# Altium project PROC114E3_SCH.PrjPcb (part 22 of 22)
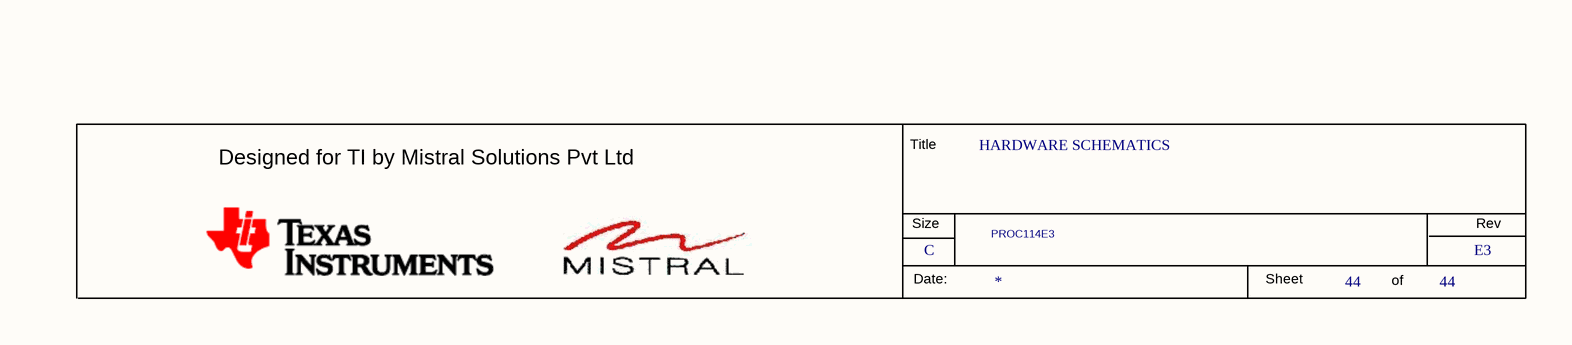
[diagram p82: 44.SchDoc, bottom right]

## Nets that join several sheets
DGND: 09 (47 pins), 10 (17 pins), 11 (31 pins), 12 (30 pins), 13 (22 pins), 14 (41 pins), 15 (120 pins), 16 (44 pins), 17 (94 pins), 18 (23 pins), 19 (16 pins), 20 (11 pins), 21 (13 pins), 22 (47 pins), 23 (47 pins), 24 (12 pins), 25 (18 pins), 26 (36 pins), 27 (49 pins), 28 (16 pins), 29 (31 pins), 30 (11 pins), 31 (70 pins), 32 (9 pins), 33 (22 pins), 34 (19 pins), 35 (17 pins), 36 (14 pins), 37 (27 pins), 38 (13 pins), 39 (12 pins), 40 (15 pins), 41 (43 pins), 42 (9 pins), 43 (14 pins)
SOC_DVDD1V8: 13 (R70.3), 14 (5 pins), 15 (6 pins)
SoC_DVDD3V3: 13 (R48.3), 14 (13 pins), 15 (15 pins)
VBUS_TYPEC2: 09 (10 pins), 35 (8 pins), 36 (R152.2)
VCC1V2_DDR: 12 (5 pins), 13 (C114.2 R134.2)
VCC1V8_CLKBUF: 24 (6 pins), 42 (C334.2 R370.2 U53.4)
VCC3V3_TA: 25 (23 pins), 26 (28 pins), 28 (6 pins)
VCC3V3_XDS: 27 (38 pins), 28 (15 pins), 29 (6 pins)
VCC_0V85: 12 (5 pins), 13 (C106.2 R123.2)
VCC_1V8: 12 (C52.1 L5.2 TP41.1 U14.3), 13 (C53.2 R70.2), 17 (13 pins), 18 (20 pins), 20 (22 pins), 24 (FL22.1), 34 (C321.1 R107.1 U20.1), 37 (5 pins), 39 (C496.2 U60.1), 40 (R446.2), 42 (C429.2 R220.1 U72.5)
VCC_3V3_SYS: 09 (R696.1), 11 (14 pins), 12 (19 pins), 13 (20 pins), 17 (C6.2 FL2.1 U2.1), 18 (7 pins), 19 (9 pins), 21 (7 pins), 22 (29 pins), 23 (29 pins), 24 (10 pins), 25 (C159.1 R218.1 U42.1), 26 (6 pins), 29 (28 pins), 30 (8 pins), 31 (16 pins), 32 (C391.1 R71.1 R73.1 U62.A2), 33 (14 pins), 34 (12 pins), 35 (R614.2 R617.2), 36 (R650.1), 37 (13 pins), 38 (5 pins), 39 (13 pins), 40 (R477.2), 41 (11 pins), 42 (7 pins), 43 (7 pins)
VCC_5V0: 09 (6 pins), 10 (8 pins), 12 (C87.1 C320.1 U19.2), 14 (R375.1), 33 (C14.1 R13.2 R15.1 U4.A2), 36 (C115.1 C356.1 U34.3), 41 (C219.1 U50.11)
VCC_CORE: 12 (5 pins), 13 (C118.2 R148.2)
VDD_1V0: 11 (C95.1 TP33.1 U24.1), 22 (14 pins), 23 (14 pins)
VDD_1V2: 11 (C17.1 TP10.1 U5.1), 41 (C201.1 C232.1 FB2.2 FB3.2)
VDD_2V5: 11 (11 pins), 16 (FL23.1), 22 (8 pins), 23 (8 pins)
VDD_CORE: 13 (R148.3 TP46.1), 14 (20 pins), 15 (20 pins)
VDD_DDR4: 13 (R134.3), 14 (5 pins), 15 (8 pins), 16 (39 pins)
VDDA1V8: 12 (C98.1 TP36.1 U27.1), 13 (C97.2 R106.2)
VDDA_1V8: 13 (R106.3), 14 (10 pins), 15 (C493.1)
VDDR_CORE: 13 (R123.3 TP38.1), 14 (8 pins), 15 (8 pins)
VDDSHV_SDIO: 12 (R101.2 TP29.1), 14 (FL14.1), 19 (8 pins)
VMAIN: 09 (5 pins), 10 (7 pins), 11 (6 pins), 25 (C491.1 R610.1 U94.2)
VPP_1V8: 11 (C86.2 TP31.1 U21.1), 14 (U12#2.J8)
AUDIO_EXT_REFCLK1: 33 (R32.1), 41 (R34.1 U7.3)
BOOTMODE0: 26 (U75.14), 32 (R518.1)
BOOTMODE1: 26 (U75.15), 32 (R516.1)
BOOTMODE2: 26 (U75.16), 32 (R513.1)
BOOTMODE3: 26 (U75.17), 32 (R511.1)
BOOTMODE4: 26 (U75.18), 32 (R508.1)
BOOTMODE5: 26 (U75.19), 32 (R506.1)
BOOTMODE6: 26 (U75.20), 32 (R504.1)
BOOTMODE7: 26 (U75.21), 32 (R501.1)
BOOTMODE8: 26 (U73.14), 32 (RA2.3)
BOOTMODE9: 26 (U73.15), 32 (RA2.4)
BOOTMODE10: 26 (U73.16), 32 (RA2.2)
BOOTMODE11: 26 (U73.17), 32 (RA1.1)
BOOTMODE12: 26 (U73.18), 32 (RA1.2)
BOOTMODE13: 26 (U73.19), 32 (RA2.1)
BOOTMODE14: 26 (U73.20), 32 (RA1.4)
BOOTMODE15: 26 (U73.21), 32 (RA1.3)
BOOTMODE_I2C_SCL: 25 (R589.1 R600.2), 26 (TP83.1 U74.29), 28 (R598.2)
BOOTMODE_I2C_SDA: 25 (R581.2 R591.1), 26 (TP84.1 U74.30), 28 (R580.2)
BOOTMODE_XDS_I2C_SCL: 27 (U45.49), 28 (R689.2 U107.2)
BOOTMODE_XDS_I2C_SDA: 27 (U45.50), 28 (R690.2 U107.3)
BT_EN_SOC: 17 (U2.2), 34 (U12#2.E8)
CLKOUT0: 24 (U52.1), 42 (R384.2 R385.2)
CONN_MCU_PORz: 34 (J9.28 R489.1), 42 (U72.1)
CONN_MCU_RESETz: 34 (J9.25 R420.1), 43 (Q2.1)
CPSW_RGMII1_ETH1_CLK: 22 (U51.15), 24 (R382.2)
CPSW_RGMII1_RD0: 22 (R86.2 R357.1 U51.33), 24 (U12#2.AB17)
CPSW_RGMII1_RD1: 22 (U51.34), 24 (U12#2.AC17)
CPSW_RGMII1_RD2: 22 (R85.2 R356.1 U51.35), 24 (U12#2.AB16)
CPSW_RGMII1_RD3: 22 (U51.36), 24 (U12#2.AA15)
CPSW_RGMII1_RX_CTL: 22 (R349.2 R350.2 U51.38), 24 (U12#2.AE17)
CPSW_RGMII1_RXC: 22 (R359.1), 24 (U12#2.AD17)
CPSW_RGMII1_TD0: 22 (U51.28), 24 (U12#2.AE20)
CPSW_RGMII1_TD1: 22 (U51.27), 24 (U12#2.AD20)
CPSW_RGMII1_TD2: 22 (U51.26), 24 (U12#2.AE18)
CPSW_RGMII1_TD3: 22 (U51.25), 24 (U12#2.AD18)
CPSW_RGMII1_TX_CTL: 22 (U51.37), 24 (U12#2.AD19)
CPSW_RGMII1_TXC: 22 (U51.29), 24 (R360.2)
CPSW_RGMII2_ETH2_CLK: 23 (U49.15), 24 (R369.2)
CPSW_RGMII2_RD0: 23 (R54.2 R322.1 U49.33), 24 (U12#2.AE23)
CPSW_RGMII2_RD1: 23 (U49.34), 24 (U12#2.AB20)
CPSW_RGMII2_RD2: 23 (R49.2 R311.1 U49.35), 24 (U12#2.AC21)
CPSW_RGMII2_RD3: 23 (U49.36), 24 (U12#2.AE22)
CPSW_RGMII2_RX_CTL: 23 (R298.2 R299.2 U49.38), 24 (U12#2.AD22)
CPSW_RGMII2_RXC: 23 (R324.1), 24 (U12#2.AD23)
CPSW_RGMII2_TD0: 23 (U49.28), 24 (U12#2.Y18)
CPSW_RGMII2_TD1: 23 (U49.27), 24 (U12#2.AA18)
CPSW_RGMII2_TD2: 23 (U49.26), 24 (U12#2.AD21)
CPSW_RGMII2_TD3: 23 (U49.25), 24 (U12#2.AC20)
CPSW_RGMII2_TX_CTL: 23 (U49.37), 24 (U12#2.AA19)
CPSW_RGMII2_TXC: 23 (U49.29), 24 (R65.2)
CPSW_RGMII_INTn: 22 (R72.2 R352.1 U51.44), 23 (R672.2 U49.44)
CPSW_RGMII_INTn/PRU_INTn: 22 (R72.1), 32 (R441.1), 42 (U12#2.D16)
CSI_GPIO1: 38 (J19.11A), 39 (U70.14)
CSI_GPIO2: 38 (J19.12A), 39 (U70.15)
CSI_I2C2_SCL: 33 (R669.2 U100.10), 38 (J19.13A)
CSI_I2C2_SDA: 33 (R668.2 U100.9), 38 (J19.14A)
EXP_CLKOUT0: 33 (J3.7), 42 (R336.1)
EXP_GPIO0_14: 33 (J3.22), 34 (U20.7)
EXP_GPIO0_14_LT: 20 (U12#2.E24), 34 (U20.2)
EXP_GPIO0_33: 32 (U12#2.L24), 33 (J3.31)
EXP_GPIO0_36: 32 (U12#2.N20), 33 (J3.29)
EXP_GPIO0_38: 32 (U12#2.V25), 33 (J3.16)
EXP_GPIO0_39: 32 (U12#2.K25), 33 (J3.18)
EXP_GPIO0_40/PR0_ECAP0_IN_APWM_OUT: 32 (U12#2.M22), 33 (J3.32)
EXP_GPIO0_41: 32 (U12#2.M21), 33 (J3.37)
EXP_GPIO0_42: 32 (U12#2.L21), 33 (J3.13)
EXP_GPIO1_22: 33 (J3.15), 42 (U12#2.A15)
EXP_HAT_DETECT: 33 (J3.39), 39 (R187.1 U70.8)
EXP_PS_3V3_EN: 33 (R274.2 U48.B2), 39 (U70.6)
EXP_PS_5V0_EN: 33 (R14.2 U4.C2), 39 (U70.7)
EXP_SPI0_CLK: 33 (J3.23), 42 (U12#2.A14)
EXP_SPI0_CS0: 33 (J3.24 R25.2), 42 (U12#2.A13)
EXP_SPI0_CS1: 33 (J3.26 R26.2), 42 (U12#2.C13)
EXP_SPI0_D0: 33 (J3.19), 42 (U12#2.B13)
EXP_SPI0_D1: 33 (J3.21), 42 (U12#2.B14)
EXP_SPI2_CLK: 33 (J3.40), 37 (U63.5)
EXP_SPI2_CS0/EHRPWM0_A: 33 (J3.12 R27.2), 37 (U63.2)
EXP_SPI2_D0: 33 (J3.38), 37 (U63.11)
EXP_SPI2_D1/ECAP2_IN_APWM_OUT: 33 (J3.35), 37 (U63.14)
EXP_UART5_RXD: 33 (J3.10), 42 (U12#2.C15)
EXP_UART5_TXD: 33 (J3.8), 42 (U12#2.E15)
GPIO1_23_INTn: 39 (R485.1), 42 (U12#2.B15), 43 (R550.2)
GPIO_AUD_RSTn: 39 (U70.9), 40 (R469.1 R474.2 U71.1)
GPIO_CPSW1_RST: 22 (R190.1 R191.1 U40.1), 39 (U70.2)
GPIO_CPSW2_RST: 23 (R195.1 R196.1 U41.1), 39 (U70.1)
GPIO_eMMC_RSTn: 18 (R427.1 U58.1), 39 (U70.10)
GPIO_HDMI_RSTn: 39 (R697.2), 41 (R389.1 R390.2 U54.1)
GPIO_OLDI_RSTn: 09 (R482.1), 37 (R475.2 U105.1), 39 (R698.2)
HDMI_INTn: 39 (U70.17), 41 (R325.2 U10.52)
HFOSC0_CLKOUT_32K: 17 (U2.3), 32 (U12#2.A12)
IO_EXP_TEST_LED: 38 (R198.1 R199.2), 39 (U70.24)
JTAG_EMU0: 29 (R605.2 U80.7), 30 (J17.13)
JTAG_EMU1: 29 (R607.2 U80.6), 30 (J17.14)
JTAG_EMU_RSTn: 30 (J17.15 R592.2), 42 (U90.6)
JTAG_TCK: 29 (R564.1 U88.14), 30 (R535.1)
JTAG_TDI: 29 (R579.1 U88.12), 30 (J17.3)
JTAG_TDO: 29 (U96.7), 30 (J17.7)
JTAG_TMS: 29 (R574.1 U88.13), 30 (J17.1)
JTAG_TRST#: 29 (R562.2 U88.15), 30 (J17.2)
MCASP1_ACLKX: 32 (R56.1), 39 (U60.7 U65.4)
MCASP1_ACLKX_AUD: 39 (U65.3), 40 (TP54.1 U66.38)
MCASP1_ACLKX_BT: 17 (MOD1.60), 39 (U60.5)
MCASP1_ACLKX_HDMI: 39 (U65.2), 41 (U10.45)
MCASP1_AFSX: 32 (R331.1), 39 (U60.8 U65.7)
MCASP1_AFSX_AUD: 39 (U65.6), 40 (TP50.1 U66.39)
MCASP1_AFSX_BT: 17 (MOD1.58), 39 (U60.4)
MCASP1_AFSX_HDMI: 39 (U65.5), 41 (U10.44)
MCASP1_AXR0: 32 (R55.1), 39 (U60.9 U65.9)
MCASP1_AXR0_AUD: 39 (U65.10), 40 (TP55.1 U66.40)
MCASP1_AXR0_BT: 17 (MOD1.56 R671.2), 39 (U60.3)
MCASP1_AXR0_HDMI: 39 (U65.11), 41 (U10.41)
MCASP1_AXR2: 32 (R654.1), 39 (U60.10 U65.12)
MCASP1_AXR2_AUD: 39 (U65.13), 40 (R437.1 TP49.1)
MCASP1_AXR2_BT: 17 (MOD1.57), 39 (U60.2)
MCU_RESETSTATz: 32 (R421.1), 34 (J9.23 TP21.1), 42 (U12#2.B12)
MCU_RESETz: 42 (U12#2.E11), 43 (R538.2 TP78.1 U82.7)
MCU_SAFETY_ERRORz_1V8: 34 (TP28.1 U20.3), 42 (U12#2.D1)
MCU_UART0_CTS_3V3: 31 (U84.9), 34 (U17.11)
MCU_UART0_RTS_3V3: 31 (U84.7), 34 (U17.14)
MCU_UART0_RX_3V3: 31 (U84.8), 34 (U17.2)
MCU_UART0_TX_3V3: 31 (R561.2 U84.6), 34 (U17.5)
MMC1_CLK: 18 (R66.1 R333.1), 19 (J20.5 R90.1 U15.6)
MMC1_CMD: 18 (U12#2.A21), 19 (J20.3 R82.1 U15.1)
MMC1_D0: 18 (U12#2.A22), 19 (J20.7 R92.1 U15.8)
MMC1_D1: 18 (U12#2.B21), 19 (J20.8 R91.1 U15.7)
MMC1_D2: 18 (U12#2.C21), 19 (J20.1 R81.1 U15.2)
MMC1_D3: 18 (U12#2.D22), 19 (J20.2 R80.1 U15.3)
MMC1_SD_EN: 19 (R117.1 U22.1), 39 (U70.4)
MMC1_SDCD: 18 (U12#2.D17), 19 (J20.9 R96.1 U18.5)
MMC2_CLK: 17 (R8.2 R9.1 R10.1), 18 (R12.1 R57.2)
MMC2_CMD: 17 (R20.1 R277.2 R282.2), 18 (U12#2.C24)
MMC2_D0: 17 (R18.1 R279.2 R284.2), 18 (U12#2.B24)
MMC2_D1: 17 (R19.1 R278.2 R283.2), 18 (U12#2.C25)
MMC2_D2: 17 (R21.1 R276.2 R281.2), 18 (U12#2.E23)
MMC2_D3: 17 (R22.1 R275.2 R280.2), 18 (U12#2.D24)
PD_I2C_IRQ: 09 (R695.1 R696.2), 39 (U70.18)
PORz_OUT: 19 (U22.6), 22 (U40.3), 23 (U41.3), 26 (R221.2), 42 (R381.1 TP34.1 U12#2.E21)
PRU_3V3_EN: 32 (R445.2 U62.B2), 39 (U70.16)
PRU_DETECT: 32 (J10.3), 39 (R193.1 U70.3)
RESETSTATz: 18 (U58.2), 19 (U22.3), 20 (U6.2), 22 (R189.1), 23 (R194.1), 26 (R222.2), 32 (R422.1), 33 (U100.3), 37 (U105.2), 39 (U70.28), 40 (U71.2), 41 (U54.2), 42 (R472.1 TP64.1 U12#2.F22)
SEL_XDS110_INV: 29 (7 pins), 30 (J17.8 U81.2 U91.2)
SoC_CLKIN: 24 (C322.1 R368.2 R372.2), 34 (R87.1)
SOC_GPIO1_49: 18 (U12#2.C17), 38 (R94.2 R95.1)
SoC_I2C0_SCL: 09 (R460.1), 21 (U26.6), 32 (J10.6), 33 (J3.28), 37 (J21.2), 42 (R391.2 U12#2.B16)
SoC_I2C0_SDA: 09 (R464.1), 21 (U26.5), 32 (J10.8), 33 (J3.27), 37 (J21.3), 42 (R392.2 U12#2.A16)
SoC_I2C1_SCL: 13 (9 pins), 21 (TP71.1 U11.1 U33.1), 25 (U42.2), 39 (U70.29), 40 (R440.1), 41 (U10.1), 42 (R491.2 U12#2.B17)
SoC_I2C1_SDA: 13 (6 pins), 21 (TP72.1 U11.6 U33.6), 25 (U42.3), 39 (U70.30), 40 (R439.1), 41 (U10.2), 42 (R490.2 U12#2.A17)
SoC_I2C1_TA_SCL: 25 (R499.2 R583.1 U42.7), 28 (R544.2)
SoC_I2C1_TA_SDA: 25 (R498.2 R590.1 U42.6), 28 (R525.2)
SoC_I2C1_XDS_SCL: 27 (U45.82), 28 (R686.2 U106.2)
SoC_I2C1_XDS_SDA: 27 (U45.81), 28 (R687.2 U106.3)
SoC_I2C2_SCL: 32 (U12#2.K22), 33 (R31.2 U100.12)
SoC_I2C2_SDA: 32 (U12#2.K24), 33 (R30.2 U100.13)
SoC_RGMII_MDC: 22 (R102.1), 23 (R673.1), 32 (U12#2.AD24)
SoC_RGMII_MDIO: 22 (R64.1), 23 (R674.1), 32 (U12#2.AB22)
SOC_SPI2_CLK: 33 (U12#2.A20), 37 (U3.8 U63.7)
SOC_SPI2_CS0: 33 (U12#2.E19), 37 (U3.6 U63.4)
SOC_SPI2_D0: 33 (U12#2.B19), 37 (U3.7 U63.9)
SOC_SPI2_D1: 33 (U12#2.A19), 37 (U3.9 U63.12)
SOC_UART0_RX_3V3: 31 (U93.8), 42 (U12#2.D14)
SOC_UART0_TX_3V3: 31 (R599.2 U93.6), 42 (U12#2.E14)
SOC_UART1_CTS: 31 (TP61.1 U97.9), 37 (U63.10)
SOC_UART1_CTS_BT: 17 (MOD1.51), 37 (U3.12)
SOC_UART1_RTS: 31 (TP60.1 U97.7), 37 (U63.13)
SOC_UART1_RTS_BT: 17 (MOD1.50), 37 (U3.14)
SOC_UART1_RX_BT: 17 (MOD1.53), 37 (U3.13)
SOC_UART1_RXD: 31 (TP57.1 U97.8), 37 (U63.3)
SOC_UART1_TX_BT: 17 (R24.2), 37 (U3.15)
SOC_UART1_TXD: 31 (R611.2 TP58.1 U97.6), 37 (U63.6)
SoC_USB0_DM: 35 (L10.4), 36 (U12#2.AE11)
SoC_USB0_DP: 35 (L10.1), 36 (U12#2.AD11)
SoC_USB0_DRVVBUS: 09 (R492.1 R625.1), 36 (U12#2.C20)
SoC_VOUT0_DATA16: 32 (RA2.6 U12#2.R24), 41 (U10.13)
SoC_VOUT0_DATA17: 32 (RA2.5 U12#2.R25), 41 (U10.11)
SoC_VOUT0_DATA18: 32 (RA2.7 U12#2.T25), 41 (U10.10)
SoC_VOUT0_DATA19: 32 (RA1.8 U12#2.R21), 41 (U10.9)
SoC_VOUT0_DATA20: 32 (RA1.7 U12#2.T22), 41 (U10.8)
SoC_VOUT0_DATA21: 32 (RA2.8 U12#2.T24), 41 (U10.7)
SoC_VOUT0_DATA22: 32 (RA1.5 U12#2.U25), 41 (U10.6)
SoC_VOUT0_DATA23: 32 (RA1.6 U12#2.U24), 41 (U10.4)
SoC_WARM_RESETZ: 42 (U12#2.F20), 43 (R572.1 TP85.1 U82.2)
TEST_GPIO1: 25 (R587.1 R596.1), 28 (R225.2), 43 (Q17.1)
TEST_GPIO1_XDS: 27 (U45.74), 28 (U108.1)
TEST_GPIO2: 25 (R567.1 R571.1 TP104.1), 28 (R231.2)
TEST_GPIO2_XDS: 27 (U45.73), 28 (U109.2)
TEST_GPIO3: 25 (R597.1 TP73.1), 26 (J14.1 R517.1 U43.2), 28 (R226.2)
TEST_GPIO3_XDS: 27 (U45.72), 28 (U108.3)
TEST_GPIO4: 25 (R568.1 R569.1 TP74.1), 26 (U74.28), 28 (R232.2)
TEST_GPIO4_XDS: 27 (U45.71), 28 (U108.5)
TEST_PORZn: 25 (R586.1 R595.1), 28 (R224.2), 42 (U90.1)
TEST_PORZn_XDS: 27 (U45.77), 28 (U108.9)
TEST_POWERDOWN: 10 (R534.1), 25 (R585.1 R594.1), 28 (R229.2)
TEST_POWERDOWN_XDS: 27 (U45.78), 28 (U108.13)
TEST_WARMRESETn: 25 (R566.1 R570.1), 28 (R230.2), 43 (Q18.1)
TEST_WARMRESETn_XDS: 27 (U45.76), 28 (U108.11)
TS_INT#: 37 (J21.9 R165.2), 39 (U70.23)
UART1_FET_BUF_EN: 37 (R660.1 U3.1 U3.16 U99.2), 39 (U70.11)
UART1_FET_SEL: 37 (R176.1 R431.2 U63.1), 39 (U70.22)
USBC_CONN2_CC1: 09 (C152.1 U68.45), 35 (D4.1 J13.A5)
USBC_CONN2_CC2: 09 (C151.1 U68.47), 35 (D10.1 J13.B5)
VCC_3V3_SYS_PG: 11 (R410.1 R453.2 U67.5), 12 (R75.1 R126.1)
VCC_5V0_PG: 10 (R509.1 R642.2), 11 (U67.7), 42 (U90.3)
VDD_0V85_PG: 12 (R142.1 U32.2 U101.1), 35 (R616.1), 42 (U72.6)
VPP_LDO_EN: 11 (R104.1 R105.1), 39 (U70.5)
VSEL_SD: 12 (R97.2 U19.1), 32 (U12#2.P25)
WKUP_I2C0_SCL: 24 (U38.15), 32 (R73.2 R74.2)
WKUP_I2C0_SDA: 24 (U38.2), 32 (R71.2 U12#2.A9)
WKUP_UART0_CTS_3V3: 31 (U92.9), 32 (U12#2.C6)
WKUP_UART0_RTS_3V3: 31 (U92.7), 32 (U12#2.A4)
WKUP_UART0_RX_3V3: 31 (U92.8), 32 (U12#2.B4)
WKUP_UART0_TX_3V3: 31 (R573.2 U92.6), 32 (U12#2.C5)
WL_LT_EN: 17 (R11.2 U2.4), 39 (U70.12)
WLAN_EN: 17 (MOD1.40 R272.1), 18 (U12#2.A23)
WLAN_IRQ: 17 (MOD1.14 R6.1), 18 (U12#2.B23)
XDS110_EMU0: 27 (R265.2 U45.42), 29 (U86.7)
XDS110_EMU1: 27 (R264.2 U45.43), 29 (U86.6)
XDS110_TCK: 27 (U45.35), 29 (U85.14)
XDS110_TDI: 27 (U45.38), 29 (U85.15)
XDS110_TDO: 27 (U45.37), 29 (U83.7)
XDS110_TMS: 27 (U45.36), 29 (U85.13)
XDS110_TRST#: 27 (U45.40), 29 (U85.12)